# EAGLE design GROUU_smartTankV0 (EAGLE 8.2.0)
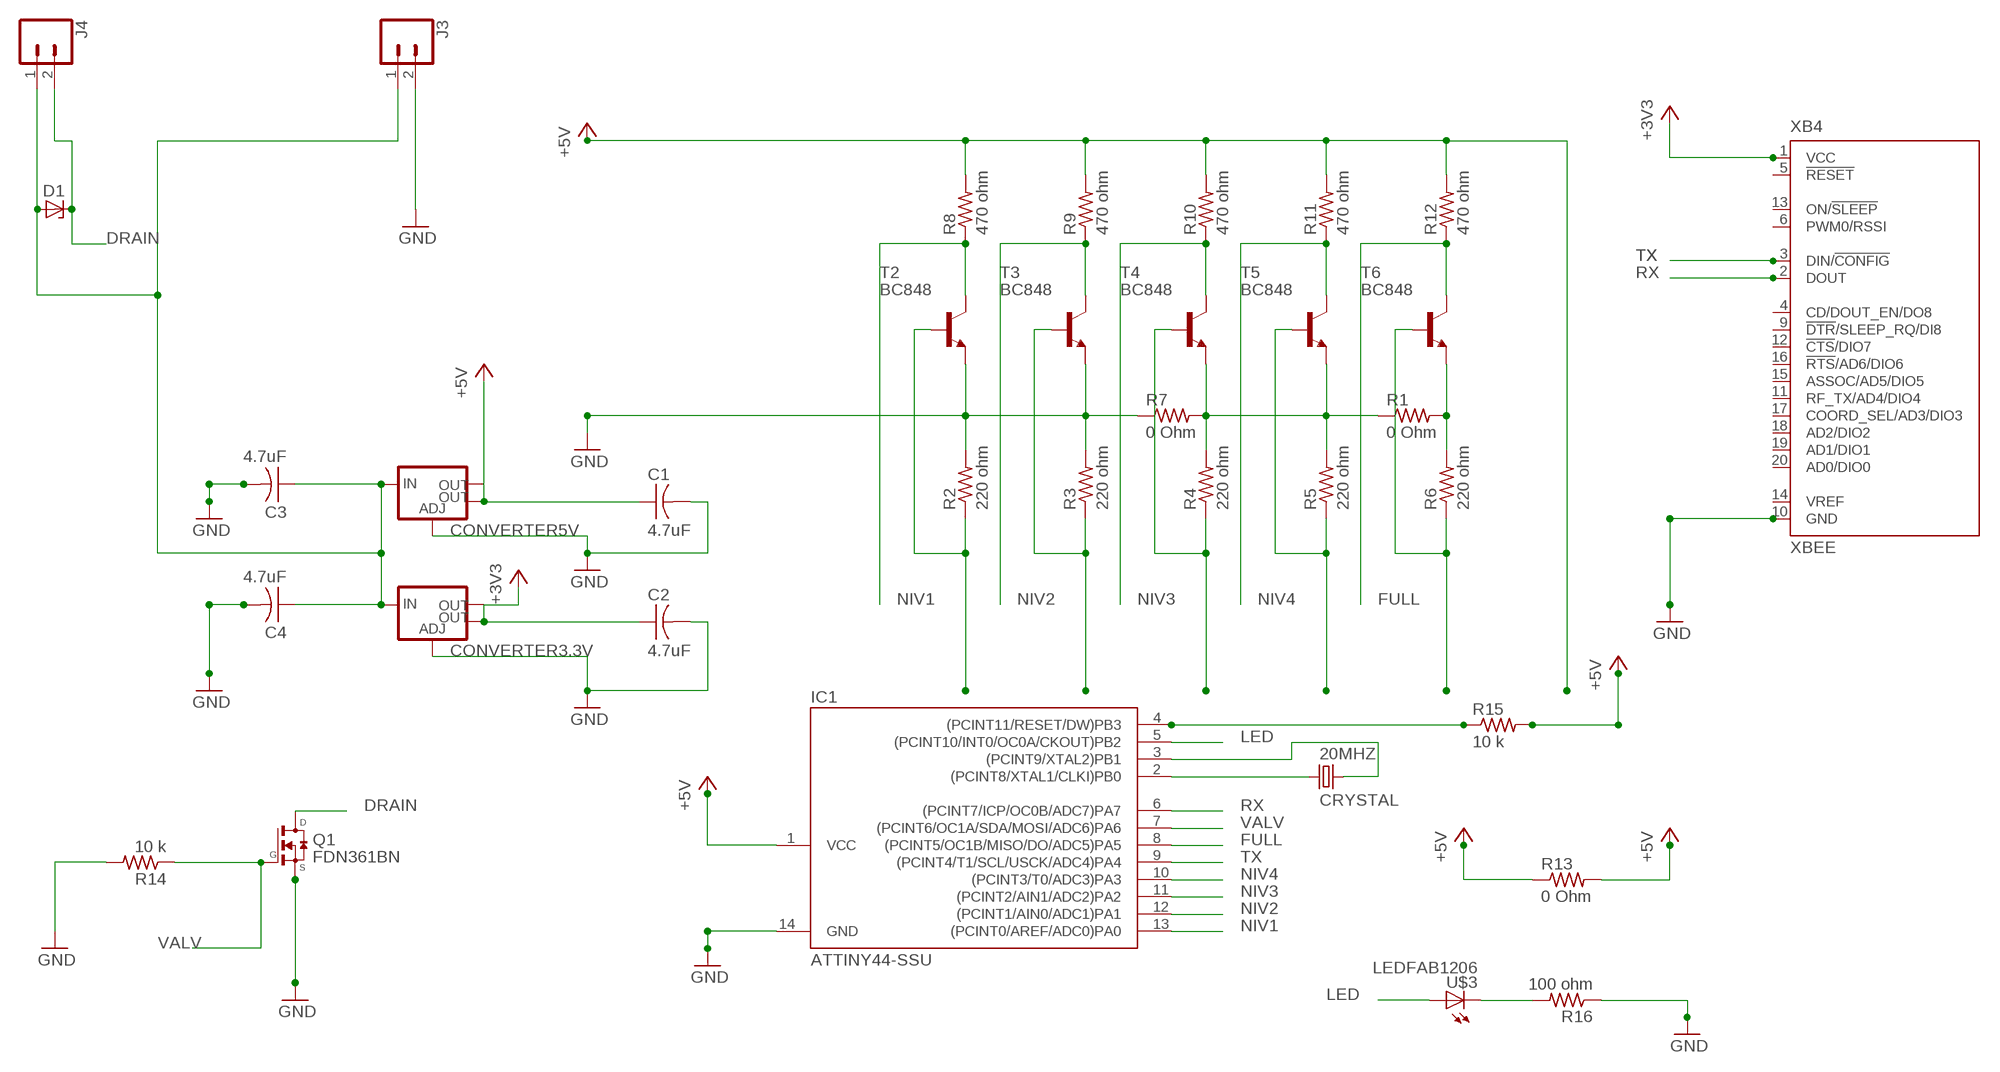
[diagram p0: schematic, sheet 1]

## Parts
20MHZ  CRYSTAL  [2-SMD-5X3MM]
C1  4.7uF  CAP-US1206FAB  [C1206FAB]
C2  4.7uF  CAP-US1206FAB  [C1206FAB]
C3  4.7uF  CAP-US1206FAB  [C1206FAB]
C4  4.7uF  CAP-US1206FAB  [C1206FAB]
CONVERTER3.3V  V_REG_LM1117SOT223  [SOT223]
CONVERTER5V  V_REG_LM1117SOT223  [SOT223]
D1  ZENER_DIODESOD123  [SOD123]
IC1  ATTINY44-SSU  [SOIC14]
J3  CONN_023.5MM  [SCREWTERMINAL-3.5MM-2]
J4  CONN_023.5MM  [SCREWTERMINAL-3.5MM-2]
Q1  FDN361BN  [SSOT-3]
R1  0 Ohm  RES-US1206FAB  [R1206FAB]
R2  220 ohm  RES-US1206FAB  [R1206FAB]
R3  220 ohm  RES-US1206FAB  [R1206FAB]
R4  220 ohm  RES-US1206FAB  [R1206FAB]
R5  220 ohm  RES-US1206FAB  [R1206FAB]
R6  220 ohm  RES-US1206FAB  [R1206FAB]
R7  0 Ohm  RES-US1206FAB  [R1206FAB]
R8  470 ohm  RES-US1206FAB  [R1206FAB]
R9  470 ohm  RES-US1206FAB  [R1206FAB]
R10  470 ohm  RES-US1206FAB  [R1206FAB]
R11  470 ohm  RES-US1206FAB  [R1206FAB]
R12  470 ohm  RES-US1206FAB  [R1206FAB]
R13  0 Ohm  RES-US1206FAB  [R1206FAB]
R14  10 k  RES-US1206FAB  [R1206FAB]
R15  10 k  RES-US1206FAB  [R1206FAB]
R16  100 ohm  RES-US1206FAB  [R1206FAB]
T2  BC848  [SOT23]
T3  BC848  [SOT23]
T4  BC848  [SOT23]
T5  BC848  [SOT23]
T6  BC848  [SOT23]
U$3  LEDFAB1206  [LED1206FAB]
XB4  XBEE  [XBEE]

## Nets
+3V3: C2.1 CONVERTER3.3V.2(OUT) CONVERTER3.3V.4(OUT) XB4.1(VCC)
+5V: C1.1 CONVERTER5V.2(OUT) CONVERTER5V.4(OUT) R8.2 R9.2 R10.2 R11.2 R12.2 R13.1 R13.2 R15.2
DRAIN: D1.CATHODE J4.2 Q1.3(D)
FULL: IC1.8((PCINT5/OC1B/MISO/DO/ADC5)PA5) R12.1 T6.3(C)
GND: C1.2 C2.2 C3.2 C4.2 CONVERTER3.3V.1(ADJ) CONVERTER5V.1(ADJ) J3.2 Q1.2(S) R2.2 R3.2 R7.1 R14.2 R16.1 T2.2(E) T3.2(E) XB4.10(GND)
LED: IC1.5((PCINT10/INT0/OC0A/CKOUT)PB2) U$3.1(A)
N$1: 20MHZ.P$1 IC1.2((PCINT8/XTAL1/CLKI)PB0)
N$2: 20MHZ.P$2 IC1.3((PCINT9/XTAL2)PB1)
N$3: C3.1 C4.1 CONVERTER3.3V.3(IN) CONVERTER5V.3(IN) D1.ANODE J3.1 J4.1
N$4: R1.2 R6.2 T6.2(E)
N$5: R1.1 R4.2 R5.2 R7.2 T4.2(E) T5.2(E)
N$6: IC1.4((PCINT11/RESET/DW)PB3) R15.1
N$8: R2.1 T2.1(B)
N$9: R3.1 T3.1(B)
N$10: R4.1 T4.1(B)
N$11: R5.1 T5.1(B)
N$12: R6.1 T6.1(B)
N$13: R16.2 U$3.2(C)
NIV1: IC1.13((PCINT0/AREF/ADC0)PA0) R8.1 T2.3(C)
NIV2: IC1.12((PCINT1/AIN0/ADC1)PA1) R9.1 T3.3(C)
NIV3: IC1.11((PCINT2/AIN1/ADC2)PA2) R10.1 T4.3(C)
NIV4: IC1.10((PCINT3/T0/ADC3)PA3) R11.1 T5.3(C)
RX: IC1.6((PCINT7/ICP/OC0B/ADC7)PA7) XB4.2(DOUT)
TX: IC1.9((PCINT4/T1/SCL/USCK/ADC4)PA4) XB4.3(DIN/!CONFIG)
VALV: IC1.7((PCINT6/OC1A/SDA/MOSI/ADC6)PA6) Q1.1(G) R14.1
Unconnected: XB4.4(CD/DOUT_EN/DO8) XB4.5(!RESET) XB4.6(PWM0/RSSI) XB4.9(!DTR!/SLEEP_RQ/DI8) XB4.11(RF_TX/AD4/DIO4) XB4.12(!CTS!/DIO7) XB4.13(ON/!SLEEP) XB4.14(VREF) XB4.15(ASSOC/AD5/DIO5) XB4.16(!RTS!/AD6/DIO6) XB4.17(COORD_SEL/AD3/DIO3) XB4.18(AD2/DIO2) XB4.19(AD1/DIO1) XB4.20(AD0/DIO0)

## Power pins joined to a net without a drawn wire
GND: IC1.14(GND)
VCC: IC1.1(VCC)

## Library data of the parts
20MHZ = fab:CRYSTAL
C1-C4 = fab:CAP-US
CONVERTER3.3V CONVERTER5V = fab:V_REG_LM1117: Voltage Regulator LM1117 Standard adjustable voltage regulator but in SMD form. Spark Fun Electronics SKU : COM-00595; PROD_ID: VREG-08170
D1 = fab:ZENER_DIODE: zener diode
IC1 = fab:ATTINY44
J3 J4 = SparkFun-Connectors:CONN_02: Multi connection point. Often used as Generic Header-pin footprint for 0.1 inch spaced/style header connections On any of the 0.1 inch spaced packages, you can populate with these: Break Away Headers - Straight <https://www.sparkfun.com/products/116> (PRT-00116) Break Away Male Headers - Right Angle <https://www.sparkfun.com/products/553> (PRT-00553) Female Headers <https://www.sparkfun.com/products/115> (PRT-00115) Break Away Headers - Machine Pin <https://www.sparkfun.com/products/117> (PRT-00117) Break Away Female Headers - Swiss Machine Pin <https://www.sparkfun.com/products/743> (PRT-00743) For SCREWTERMINALS and SPRING TERMINALS visit here: Screw Terimnals on SparkFun.com <https://www.sparkfun.com/search/results?term=Screw+Terminals> (5mm/3.5mm/2.54mm spacing) This device is also useful as a general connection point to wire up your design to another part of your project. Our various solder wires solder well into these plated through hole pads. Hook-Up Wire - Assortment (Stranded, 22 AWG) <https://www.sparkfun.com/products/11375> (PRT-11375) Hook-Up Wire - Assortment (Solid Core, 22 AWG) <https://www.sparkfun.com/products/11367> (PRT-11367) View the entire wire category on our website here <https://www.sparkfun.com/categories/141> Special notes: Molex polarized connector foot print use with: PRT-08233 with associated crimp pins and housings. 2.54_SCREWTERM for use with PRT-10571. 3.5mm Screw Terminal footprints for PRT-08084 5mm Screw Terminal footprints for use with PRT-08432; PROD_ID: CONN-08399
Q1 = transistor-fet:FDN361BN: N-Channel MOSFET 30V, Logic Level, PowerTrench
R1-R16 = fab:RES-US: Resistor (US Symbol) Variants with postfix FAB are widened to allow the routing of internal traces
T2-T6 = transistor:BC848: NPN TRANSISTOR
U$3 = fab:LED: LED
XB4 = maxstream:XBEE: XBee (TM) /XBee-PRO(TM) OEM RF Modules Source: MaxStream, Inc. xbee_productmanual.pdf; MPN: XBP24-Z7UIT-004; OC_FARNELL: 1751799; OC_NEWARK: 34R5507

## Board
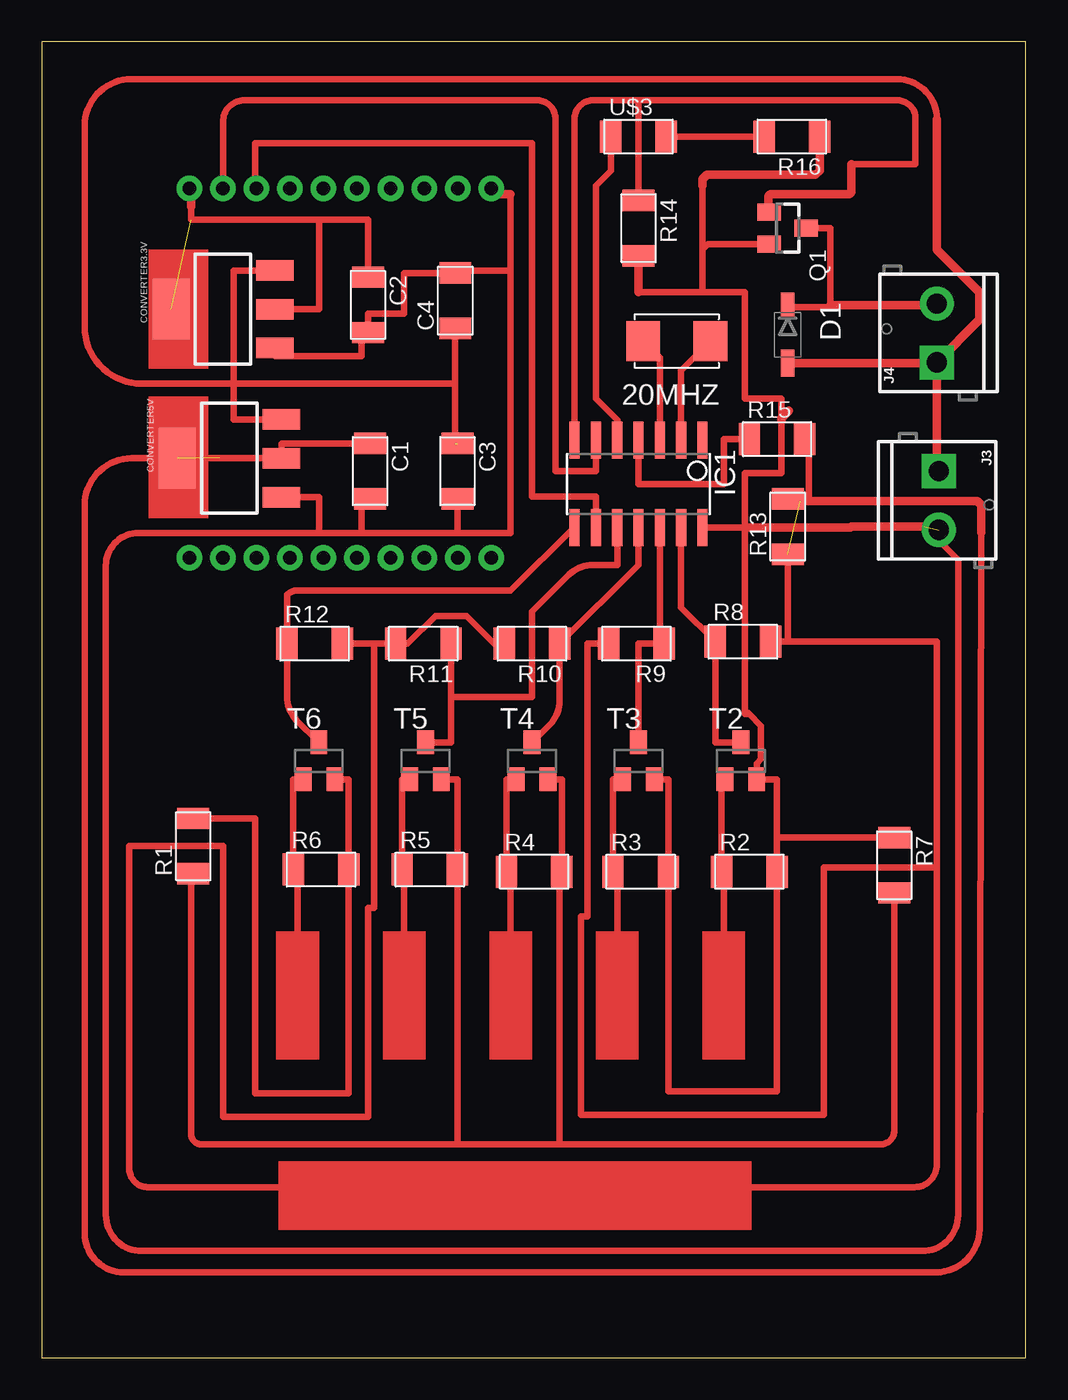
[diagram p1: board, top side]
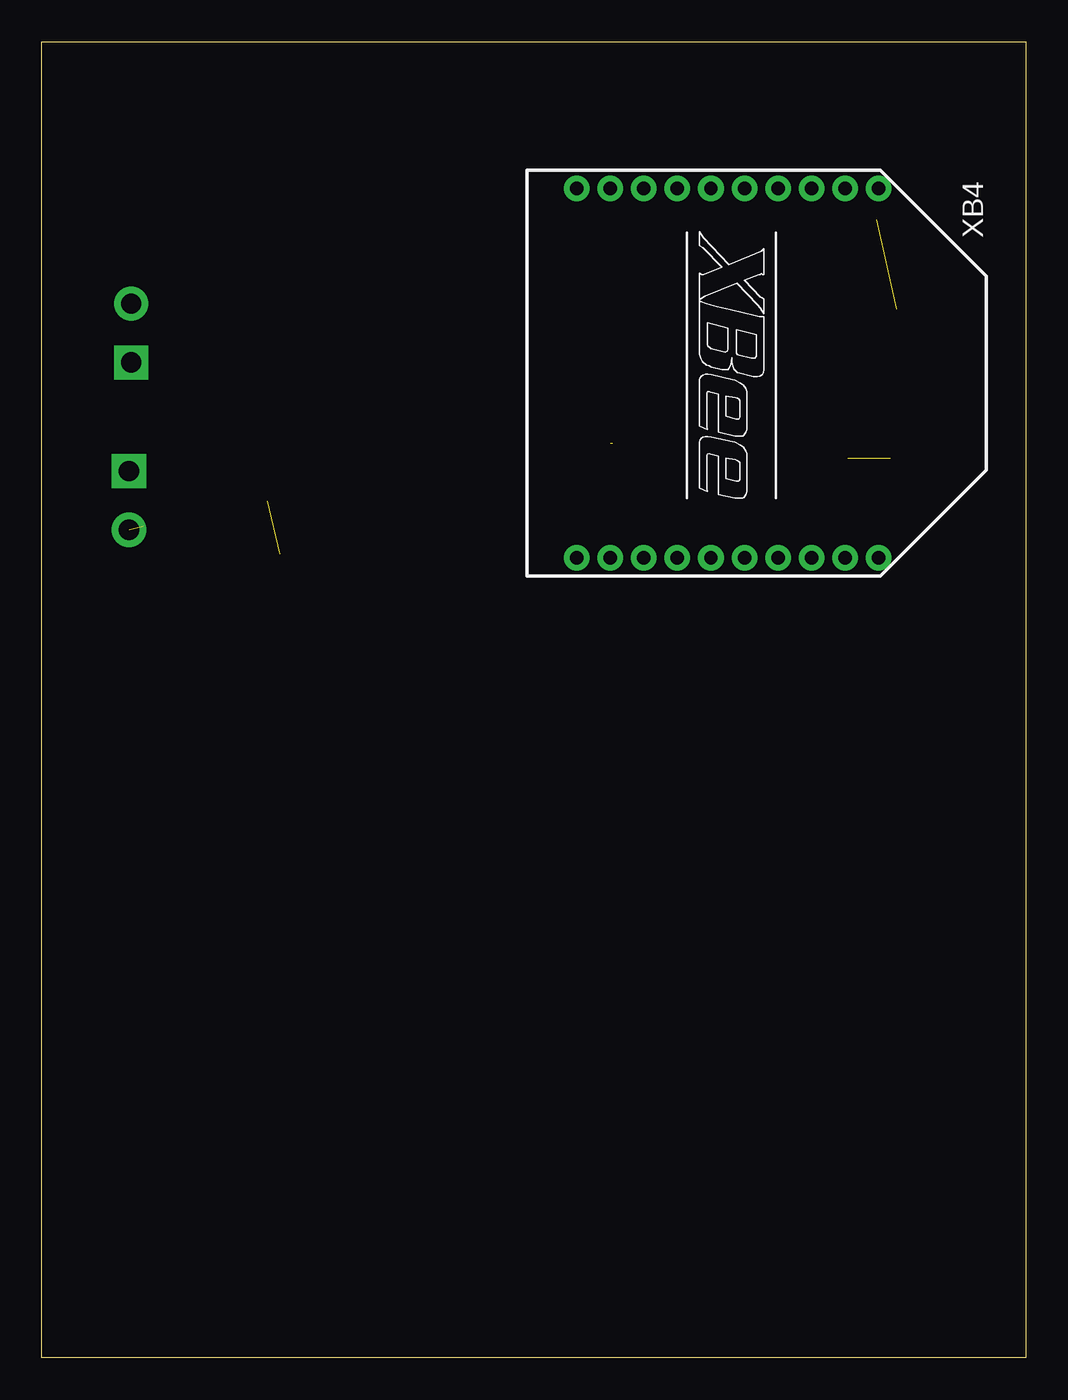
[diagram p2: board, bottom side, seen from below]

Size 58.65 x 78.41 mm. Coordinates in mm from the lower left corner, seen from the top.
Outline: 0,0 58.65,0 58.65,78.41 0,78.41 0,0
Copper layers (1*16): Top 0.035mm / dielectric 1.5mm / Bottom 0.035mm
Design rules "default *": minimum track width 0.4mm, minimum drill 0.4mm, track to track 0.4mm, track to pad 0.4mm, pad to pad 0.4mm, via to via 0.4mm, smd to smd 0.4mm, copper to edge 40mil, drill to drill 0.8mm, minimum pad ring 10mil, minimum via ring 8mil, stop-mask expansion 4mil, vias tented up to drill 0mil, thermal gap 10mil

### Footprints (pad centres in the part's own frame; a part is rotated, then mirrored left to right if it is on the bottom)
2-SMD-5X3MM = smd 2 x 2.4: P$1 -2,0; P$2 2,0
C1206FAB = smd 1.27 x 1.905: 1 -1.651,0; 2 1.651,0
SOT223 = smd 1.219 x 2.235: 1 -2.311,-3.099; 2 0,-3.099; 3 2.311,-3.099 | smd 3.6 x 2.2: 4 0,3.099
SOD123 = smd 1.6 x 0.8: ANODE 1.7,0; CATHODE -1.7,0
SOIC14 = smd 0.61 x 2.21: 1 -3.81,-2.603; 2 -2.54,-2.603; 3 -1.27,-2.603; 4 0,-2.603; 5 1.27,-2.603; 6 2.54,-2.603; 7 3.81,-2.603; 8 3.81,2.603; 9 2.54,2.603; 10 1.27,2.603; 11 0,2.603; 12 -1.27,2.603; 13 -2.54,2.603; 14 -3.81,2.603
SCREWTERMINAL-3.5MM-2 = drill 1.2 pad 2.032 square: 1 0,0 | drill 1.2 pad 2.032: 2 3.5,0
SSOT-3 = smd 1 x 1.4: 1 -0.95,-1.1; 2 0.95,-1.1; 3 0,1.1
R1206FAB = smd 1.27 x 1.905: 1 -1.651,0; 2 1.651,0
SOT23 = smd 1 x 1.4: 1 -0.95,-1.1; 2 0.95,-1.1; 3 0,1.1
LED1206FAB = smd 1.27 x 1.905: 1 -1.651,0; 2 1.651,0
XBEE = drill 0.8 pad 1.524: 1 -11,9; 2 -11,7; 3 -11,5; 4 -11,3; 5 -11,1; 6 -11,-1; 7 -11,-3; 8 -11,-5; 9 -11,-7; 10 -11,-9; 11 11,-9; 12 11,-7; 13 11,-5; 14 11,-3; 15 11,-1; 16 11,1; 17 11,3; 18 11,5; 19 11,7; 20 11,9

### Placement (x,y rotation side)
20MHZ  37.85,60.58 180 top
C1  19.56,52.83 270 top
C2  19.43,62.74 270 top
C3  24.76,52.83 270 top
C4  24.64,62.99 90 top
CONVERTER3.3V  10.79,62.48 90 top
CONVERTER5V  11.18,53.59 90 top
D1  44.45,60.96 270 top
IC1  35.56,52.07 180 top
J3  53.47,52.83 270 top
J4  53.34,59.31 90 top
Q1  44.45,67.31 270 top
R1  9.02,30.48 90 top
R2  42.16,28.96 0 top
R3  35.69,28.96 0 top
R4  29.34,28.96 0 top
R5  23.11,29.08 0 top
R6  16.64,29.08 0 top
R7  50.8,29.34 270 top
R8  41.78,42.67 0 top
R9  35.43,42.55 180 top
R10  29.21,42.55 180 top
R11  22.73,42.55 180 top
R12  16.26,42.55 0 top
R13  44.45,49.53 90 top
R14  35.56,67.31 270 top
R15  43.81,54.74 0 top
R16  44.7,72.77 180 top
T2  41.66,35.56 0 top
T3  35.56,35.56 0 top
T4  29.21,35.56 0 top
T5  22.86,35.56 0 top
T6  16.51,35.56 0 top
U$3  35.56,72.77 0 top
XB4  17.78,58.67 270 bottom

### Tracks (layer width: path | path; a pad name or v marks a point on that pad's centre or on a via)
+3V3  (1 unrouted)
  Top 0.152: 8.78,68.69 8.89,68.58
  Top 0.4: CONVERTER3.3V.2 16.51,62.48 16.51,67.82 | 8.89,68.58 8.89,67.82 16.51,67.82 | 16.51,67.82 19.43,67.82 C2.1
  Top 0.5: 8.89,68.58 8.89,69.56 XB4.1
+5V  (2 unrouted)
  Top 0.4: R10.2 26.96,42.55 25.31,44.2 23.46,44.2 21.81,42.55 R11.2 19.81,42.55 | 19.81,42.55 R12.2 | 44.45,42.67 R8.2 | 44.45,42.67 53.34,42.67 53.34,29.21 | 53.34,29.21 53.34,11.49 arc-90 52.01,10.16 6.28,10.16 arc-90 5.21,11.23 5.21,30.48 10.79,30.48 10.79,14.35 19.43,14.35 19.43,26.8 19.81,26.8 19.81,42.55 | 53.34,29.21 46.61,29.21 46.61,14.48 32.13,14.48 32.13,26.29 32.51,26.29 32.51,42.55 R9.2 | CONVERTER5V.2 10.61,53.59 | CONVERTER5V.2 5.35,53.59 arc90 2.54,50.78 2.54,7.43 arc90 4.89,5.08 53.29,5.08 arc90 55.89,7.67 56,49.17 | R13.2 45.08,51.18 45.72,51.18 45.72,54.74 R15.2 | R13.1 44.45,42.67 | C1.1 14.27,54.48 CONVERTER5V.2
  Top 0.5: 56,49.17 56,50.81 55.75,51.05 45.21,51.05 45.08,51.18
DRAIN
  Top 0.4: Q1.3 46.99,67.31 46.99,62.74 47.12,62.61 44.5,62.61 D1.CATHODE
  Top 0.5: 46.99,62.74 53.27,62.74 J4.2
FULL
  Top 0.4: IC1.8 arc45 31.64,49.42 27.94,45.72 15.22,45.72 arc45 14.6,45.47 R12.1 14.6,39.39 arc45 15.19,37.98 T6.3
GND  (1 unrouted)
  Top 0.4: 43.81,30.99 R2.2 43.81,15.88 37.34,15.88 R3.2 37.34,34.46 T3.2 | 43.81,30.99 43.81,34.46 T2.2 42.61,35.42 42.86,35.67 42.86,37.65 42.16,38.35 | 42.1,38.41 42.16,38.35 | R7.1 43.81,30.99 | 42.16,38.35 41.91,38.35 41.91,49.47 | CONVERTER5V.1 16.51,51.28 16.51,49.15 | 19.05,49.15 24.76,49.15 | 19.05,49.15 16.51,49.15 | 24.76,49.15 27.94,49.15 27.94,64.77 | CONVERTER3.3V.1 13.89,59.69 19.05,59.69 19.05,61.09 C2.2 19.43,62.23 21.59,62.23 21.59,64.64 C4.2 24.64,64.77 27.94,64.77 | 27.94,64.77 27.94,69.34 | IC1.14 41.91,49.47 | 16.51,49.15 5.76,49.15 arc90 3.81,47.2 3.81,8.5 arc90 5.96,6.35 52.46,6.35 arc90 54.61,8.5 54.61,47.53 52.61,49.53 | C3.2 24.76,49.15 | C1.2 19.05,51.18 19.05,49.15 | 35.56,63.5 39.37,63.5 | 39.37,63.5 41.91,63.5 41.91,57.15 44.07,57.15 44.07,55.88 44.07,52.7 41.91,52.7 41.91,49.47 | 39.37,66.04 39.37,69.85 | 39.37,66.04 39.37,63.5 | Q1.2 39.69,66.36 39.37,66.04
  Top 0.5: 44.52,56.44 44.08,56 44.08,55.89 44.07,55.88 | 41.91,49.47 48.2,49.47 48.26,49.53 52.61,49.53 | R14.2 35.56,63.5 | 39.37,69.85 39.37,70.23 39.62,70.48 46.1,70.48 46.36,70.74 R16.1 | 27.94,69.34 27.11,69.34 XB4.10
LED
  Top 0.4: U$3.1 33.91,70.74 33.02,69.85 33.02,57.15 34.29,55.88 IC1.5
N$1
  Top 0.4: IC1.2 38.1,58.83 20MHZ.P$1
N$2
  Top 0.4: IC1.3 36.83,59.59 20MHZ.P$2
N$3  (1 unrouted)
  Top 0.4: CONVERTER5V.3 11.43,55.91 11.43,58.04 | CONVERTER3.3V.3 13.89,64.77 11.43,64.77 11.43,58.04 | 11.43,58.04 5.96,58.04 arc-90 2.54,61.46 2.54,73.39 arc-90 5.35,76.2 50.96,76.2 arc-90 53.34,73.82 | C4.1 24.64,58.04 | 24.64,58.04 11.43,58.04 | 24.64,58.04 24.64,54.48
  Top 0.5: D1.ANODE 53.29,59.26 J4.1 | J4.1 55.88,61.85 55.88,63.5 53.34,66.04 53.34,73.82 | J4.1 53.34,52.96 J3.1
N$4
  Top 0.4: T6.2 18.29,34.46 R6.2 18.29,15.75 12.7,15.75 12.7,32.13 R1.2
N$5
  Top 0.4: T5.2 24.76,34.46 R5.2 24.76,12.7 | T4.2 30.99,34.46 R4.2 30.86,28.96 30.86,12.7 30.48,12.7 | R1.1 8.89,28.83 8.89,13.34 arc90 9.52,12.7 24.76,12.7 | 24.76,12.7 30.48,12.7 | 30.48,12.7 49.98,12.7 arc90 50.8,13.52 R7.2
N$6
  Top 0.4: R15.1 40.64,54.74 40.64,52.07 35.56,52.07 IC1.4
N$8
  Top 0.4: T2.1 40.51,34.46 R2.1 40.64,28.96 40.64,24.13
N$9
  Top 0.4: T3.1 34.04,34.46 R3.1 34.29,28.96 34.29,24.13
N$10
  Top 0.4: T4.1 27.69,34.46 R4.1 27.94,28.96 27.94,24.13
N$11
  Top 0.4: T5.1 21.46,34.46 R5.1 21.59,29.08 21.59,24.13
N$12
  Top 0.4: T6.1 14.99,34.46 R6.1 15.24,29.08 15.24,24.13
N$13
  Top 0.4: U$3.2 R16.2
NIV1
  Top 0.4: IC1.13 38.1,44.7 R8.1 40.13,36.66 T2.3
NIV2
  Top 0.4: IC1.12 36.83,42.55 R9.1 35.56,42.55 T3.3
NIV3
  Top 0.4: IC1.11 35.56,47.24 R10.1 30.86,39.14 arc-45 30.27,37.72 T4.3
NIV4
  Top 0.4: T5.3 24.38,36.66 24.38,39.37 | 24.38,39.37 R11.1 | IC1.10 34.29,47.25 32.83,47.25 arc45 31.42,46.66 29.21,44.45 29.21,39.37 24.38,39.37
RX
  Top 0.152: XB4.2 10.78,69.83 10.79,69.85
  Top 0.4: 10.79,69.42 10.79,69.85 10.79,73.66 arc-90 12.06,74.93 29.53,74.93 arc-90 30.61,73.86 30.61,52.83 33.02,52.83 IC1.6
TX
  Top 0.152: 12.7,71.12 12.7,69.75 XB4.3
  Top 0.4: IC1.9 33.02,51.31 29.21,51.31 29.21,72.39 12.7,72.39 12.7,71.12 12.7,69.61
VALV
  Top 0.4: 35.56,74.93 32.83,74.93 arc90 31.75,73.86 IC1.7 | R14.1 35.56,74.93 | 35.56,74.93 50.99,74.93 arc-90 52.07,73.86 52.07,71.12 48.26,71.12 | Q1.1 43.18,68.43
  Top 0.5: 48.26,71.12 48.26,69.47 48.13,69.34 43.43,69.34 43.31,69.22 43.31,68.3 Q1.1
(copper drawn outside any net)
  shapes: Top area x14

### Text on the board
Top: BOTTOM PROBE | BOTTOM PROBE | BOTTOM PROBE | BOTTOM PROBE | BOTTOM PROBE